# Altium project STM32电子相册.PrjPcb
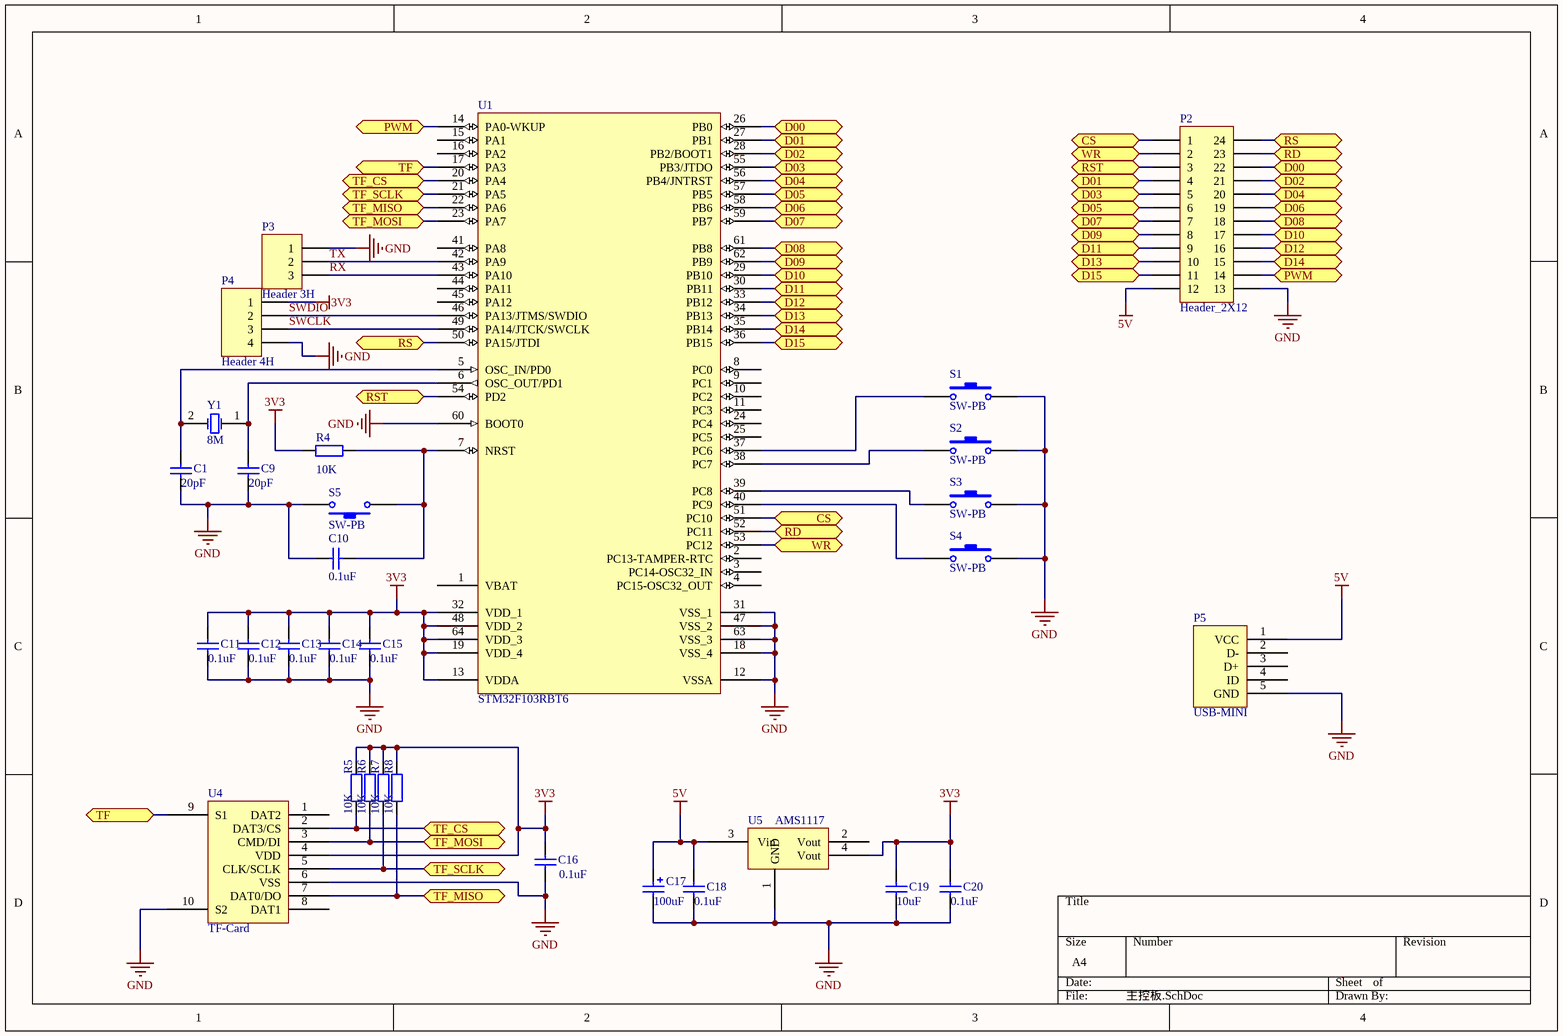
[diagram p0: 主控板.SchDoc]
1 sheet, 31 parts. Net scope: flat (ports and power ports of the same name join across sheets).
Board files: 液晶板.PcbDoc, 主控板.PcbDoc

## Sheet 主控板.SchDoc
size A4

### Parts
C1  value 20pF  [6-0805_N]  (hidden comment: Cap Semi)
C9  value 20pF  [6-0805_N]  (hidden comment: Cap Semi)
C10  value 0.1uF  [1608[0603]]  (hidden comment: Cap Semi)
C11  value 0.1uF  [1608[0603]]  (hidden comment: Cap Semi)
C12  value 0.1uF  [1608[0603]]  (hidden comment: Cap Semi)
C13  value 0.1uF  [1608[0603]]  (hidden comment: Cap Semi)
C14  value 0.1uF  [1608[0603]]  (hidden comment: Cap Semi)
C15  value 0.1uF  [1608[0603]]  (hidden comment: Cap Semi)
C16  value 0.1uF  [1608[0603]]  (hidden comment: Cap Semi)
C17  value 100uF  [3528]  (hidden comment: Cap Pol2)
C18  value 0.1uF  [1608[0603]]  (hidden comment: Cap Semi)
C19  value 10uF  [1608[0603]]  (hidden comment: Cap Semi)
C20  value 0.1uF  [1608[0603]]  (hidden comment: Cap Semi)
P2  Header_2X12  [HDR2X12]
P3  Header 3H  [HDR1X3H]
P4  Header 4H  [HDR1X4H]
P5  USB-MINI  [USB-MINI]
R4  value 10K  [1608[0603]]  (hidden comment: Res2)
R5  value 10K  [1608[0603]]  (hidden comment: Res2)
R6  value 10K  [1608[0603]]  (hidden comment: Res2)
R7  value 10K  [1608[0603]]  (hidden comment: Res2)
R8  value 10K  [1608[0603]]  (hidden comment: Res2)
S1  SW-PB  [SW-SMD]
S2  SW-PB  [SW-SMD]
S3  SW-PB  [SW-SMD]
S4  SW-PB  [SW-SMD]
S5  SW-PB  [SW-SMD]
U1  STM32F103RBT6  [LQFP64_N]
U4  TF-Card  [TF-Card]
U5  AMS1117  [SOT223]
Y1  8M  [XTAL - duplicate]

### Ports
CS, D00, D01, D02, D03, D04, D05, D06, D07, D08, D09, D10, D11, D12, D13, D14, D15, PWM, RD, RS, RST, TF, TF_CS, TF_MISO, TF_MOSI, TF_SCLK, WR

### Nets
3V3: C11.2 C12.2 C13.2 C14.2 C15.2 C16.2 C19.2 C20.2 P4.1 R4.1 R5.2 R6.2 R7.2 R8.2 U1.13(VDDA) U1.19(VDD_4) U1.32(VDD_1) U1.48(VDD_2) U1.64(VDD_3) U4.4(VDD) U5.4(Vout)
5V: C17.1 C18.2 P2.12 P5.1(VCC) U5.3(Vin)
GND: C1.1 C9.1 C10.2 C11.1 C12.1 C13.1 C14.1 C15.1 C16.1 C17.2 C18.1 C19.1 C20.1 P2.13 P3.1 P4.4 P5.5(GND) S1.2 S2.2 S3.2 S4.2 S5.2 U1.12(VSSA) U1.18(VSS_4) U1.31(VSS_1) U1.47(VSS_2) U1.60(BOOT0) U1.63(VSS_3) U4.6(VSS) U4.10(S2) U5.1(GND)
RX: P3.3 U1.43(PA10)
SWCLK: P4.3 U1.49(PA14/JTCK/SWCLK)
SWDIO: P4.2 U1.46(PA13/JTMS/SWDIO)
TX: P3.2 U1.42(PA9)
NetC1_2: C1.2 U1.5(OSC_IN/PD0) Y1.2(OSC2)
NetC9_2: C9.2 U1.6(OSC_OUT/PD1) Y1.1(OSC1)
NetC10_1: C10.1 R4.2 S5.1 U1.7(NRST)
NetP2_1: P2.1 U1.51(PC10) ; port CS
NetP2_2: P2.2 U1.53(PC12) ; port WR
NetP2_3: P2.3 U1.54(PD2) ; port RST
NetP2_4: P2.4 U1.27(PB1) ; port D01
NetP2_5: P2.5 U1.55(PB3/JTDO) ; port D03
NetP2_6: P2.6 U1.57(PB5) ; port D05
NetP2_7: P2.7 U1.59(PB7) ; port D07
NetP2_8: P2.8 U1.62(PB9) ; port D09
NetP2_9: P2.9 U1.30(PB11) ; port D11
NetP2_10: P2.10 U1.34(PB13) ; port D13
NetP2_11: P2.11 U1.36(PB15) ; port D15
NetP2_14: P2.14 U1.14(PA0-WKUP) ; port PWM
NetP2_15: P2.15 U1.35(PB14) ; port D14
NetP2_16: P2.16 U1.33(PB12) ; port D12
NetP2_17: P2.17 U1.29(PB10) ; port D10
NetP2_18: P2.18 U1.61(PB8) ; port D08
NetP2_19: P2.19 U1.58(PB6) ; port D06
NetP2_20: P2.20 U1.56(PB4/JNTRST) ; port D04
NetP2_21: P2.21 U1.28(PB2/BOOT1) ; port D02
NetP2_22: P2.22 U1.26(PB0) ; port D00
NetP2_23: P2.23 U1.52(PC11) ; port RD
NetP2_24: P2.24 U1.50(PA15/JTDI) ; port RS
NetR5_1: R5.1 U1.20(PA4) U4.2(DAT3/CS) ; port TF_CS
NetR6_1: R6.1 U1.23(PA7) U4.3(CMD/DI) ; port TF_MOSI
NetR7_1: R7.1 U1.21(PA5) U4.5(CLK/SCLK) ; port TF_SCLK
NetR8_1: R8.1 U1.22(PA6) U4.7(DAT0/DO) ; port TF_MISO
NetS1_1: S1.1 U1.37(PC6)
NetS2_1: S2.1 U1.38(PC7)
NetS3_1: S3.1 U1.39(PC8)
NetS4_1: S4.1 U1.40(PC9)
NetU1_17: U1.17(PA3) U4.9(S1) ; port TF

Not connected (* = marked no-connect by the designer): P5 2(D-) 3(D+) 4(ID); U1 1(VBAT) 2(PC13-TAMPER-RTC) 3(PC14-OSC32_IN) 4(PC15-OSC32_OUT) 8(PC0) 9(PC1) 10(PC2) 11(PC3) 15(PA1) 16(PA2) 24(PC4) 25(PC5) 41(PA8) 44(PA11) 45(PA12); U4 1(DAT2) 8(DAT1); U5 2(Vout)

### Library data of the parts
C1 C9-C16 C18-C20 = Cap Semi: Capacitor (Semiconductor SIM Model); Published: 8-Jun-2000; LatestRevisionDate: 29-May-2009; LatestRevisionNote: IPC-7351 Footprint Added.; PackageReference: C1206; Publisher: Altium Limited; PackageDescription: Chip Capacitor
C17 = Cap Pol2: Polarized Capacitor (Axial); Published: 8-Jun-2000; LatestRevisionDate: 17-Jul-2002; LatestRevisionNote: Re-released for DXP Platform.; PackageReference: POLAR0.8; Publisher: Altium Limited; PackageDescription: Polarized Capacitor; 2 Leads
P3 = Header 3H: Header, 3-Pin, Right Angle; LatestRevisionDate: 17-Jul-2002; LatestRevisionNote: Re-released for DXP Platform.; Publisher: Altium Limited
P4 = Header 4H: Header, 4-Pin, Right Angle; LatestRevisionDate: 17-Jul-2002; LatestRevisionNote: Re-released for DXP Platform.; Publisher: Altium Limited
P5 = USB-MINI: USB接口
R4-R8 = Res2: Resistor; Published: 8-Jun-2000; LatestRevisionDate: 17-Jul-2002; LatestRevisionNote: Re-released for DXP Platform.; PackageReference: AXIAL-0.4; Publisher: Altium Limited; PackageDescription: Axial Device, Thru-Hole; 2 Leads; 0.4 in Pin Spacing
S1-S5 = SW-PB: Switch; Published: 24-Mar-1999; LatestRevisionDate: 17-Jul-2002; LatestRevisionNote: Re-released for DXP Platform.; PackageReference: SPST-2; Publisher: Altium Limited; PackageDescription: Switch; 2 Leads
U1 = STM32F103RBT6: STM32 ARM-based 32-bit MCU with 128 Kbytes Flash, 64-pin LQFP, Industrial Temperature; Published: 30-May-2008; DatasheetVersion: rev6, Mar-2008; PackageVersion: Mar-2008; PackageReference: LQFP64; Publisher: Altium Limited; PackageDescription: 64-Pin Low-Profile Quad Flat Pack, 10 x 10 mm Body, 0.5 mm Pitch (LQFP64); ComponentLink1Description: Manufacturer Link; ComponentLink1URL: www.st.com/stm32; ComponentLink2Description: Datasheet; ComponentLink2URL: http://www.st.com/stonline/products/literature/ds/13587.pdf
U4 = TF-Card: TF存储卡
U5 = AMS1117: 稳压IC
Y1 = XTAL: Crystal Oscillator; Published: 8-Jun-2000; LatestRevisionDate: 17-Jul-2002; LatestRevisionNote: Re-released for DXP Platform.; PackageReference: R38; Publisher: Altium Limited; PackageDescription: Crystal, Thru-Hole; 2 Leads; Body 3.1 x 8.2 mm (Dia.xH)